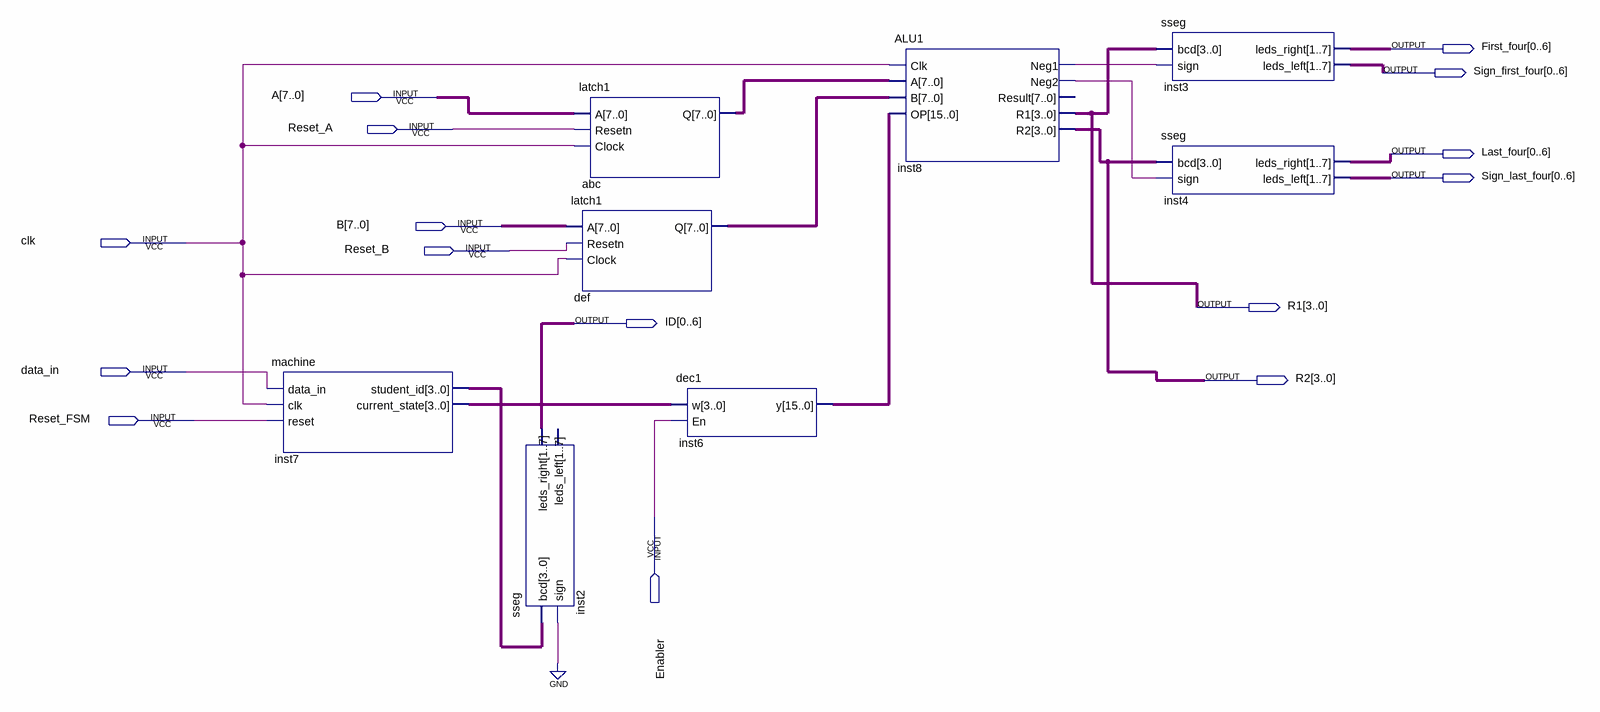
[diagram p0: schematic sheet]
// Quartus schematic pb1.bdf as structural Verilog: 8 symbols, 15 pins
module pb1 (
  input  [7:0] A,
  input  Reset_A,
  input  [7:0] B,
  input  clk,
  input  Reset_B,
  input  data_in,
  input  Reset_FSM,
  input  Enabler,
  output [0:6] First_four,
  output [0:6] Sign_first_four,
  output [0:6] Last_four,
  output [0:6] Sign_last_four,
  output [3:0] R1,
  output [0:6] ID,
  output [3:0] R2
);

  wire inst8_neg1, inst8_neg2;
  wire [3:0] inst7_current_state, inst7_student_id;
  wire [7:0] abc_q, def_q;
  wire [15:0] inst6_y;

  machine inst7 (
    .data_in(data_in), .clk(clk), .reset(Reset_FSM), .student_id(inst7_student_id),
    .current_state(inst7_current_state));
  sseg inst2 (.bcd(inst7_student_id), .sign(1'b0), .leds_right(ID));  // open: leds_left
  latch1 abc (.A(A), .Resetn(Reset_A), .Clock(clk), .Q(abc_q));
  latch1 def (.A(B), .Resetn(Reset_B), .Clock(clk), .Q(def_q));
  dec1 inst6 (.w(inst7_current_state), .En(Enabler), .y(inst6_y));
  ALU1 inst8 (
    .Clk(clk), .A(abc_q), .B(def_q), .OP(inst6_y), .Neg1(inst8_neg1), .Neg2(inst8_neg2), .R1(R1), .R2(R2));  // open: Result
  sseg inst3 (.bcd(R1), .sign(inst8_neg1), .leds_right(First_four), .leds_left(Sign_first_four));
  sseg inst4 (.bcd(R2), .sign(inst8_neg2), .leds_right(Last_four), .leds_left(Sign_last_four));
endmodule
